# Altium schematic sheet shop roaster psu module board 1.SchDoc
size 420 x 297 mm; SheetNumber: 1; SheetTotal: 1
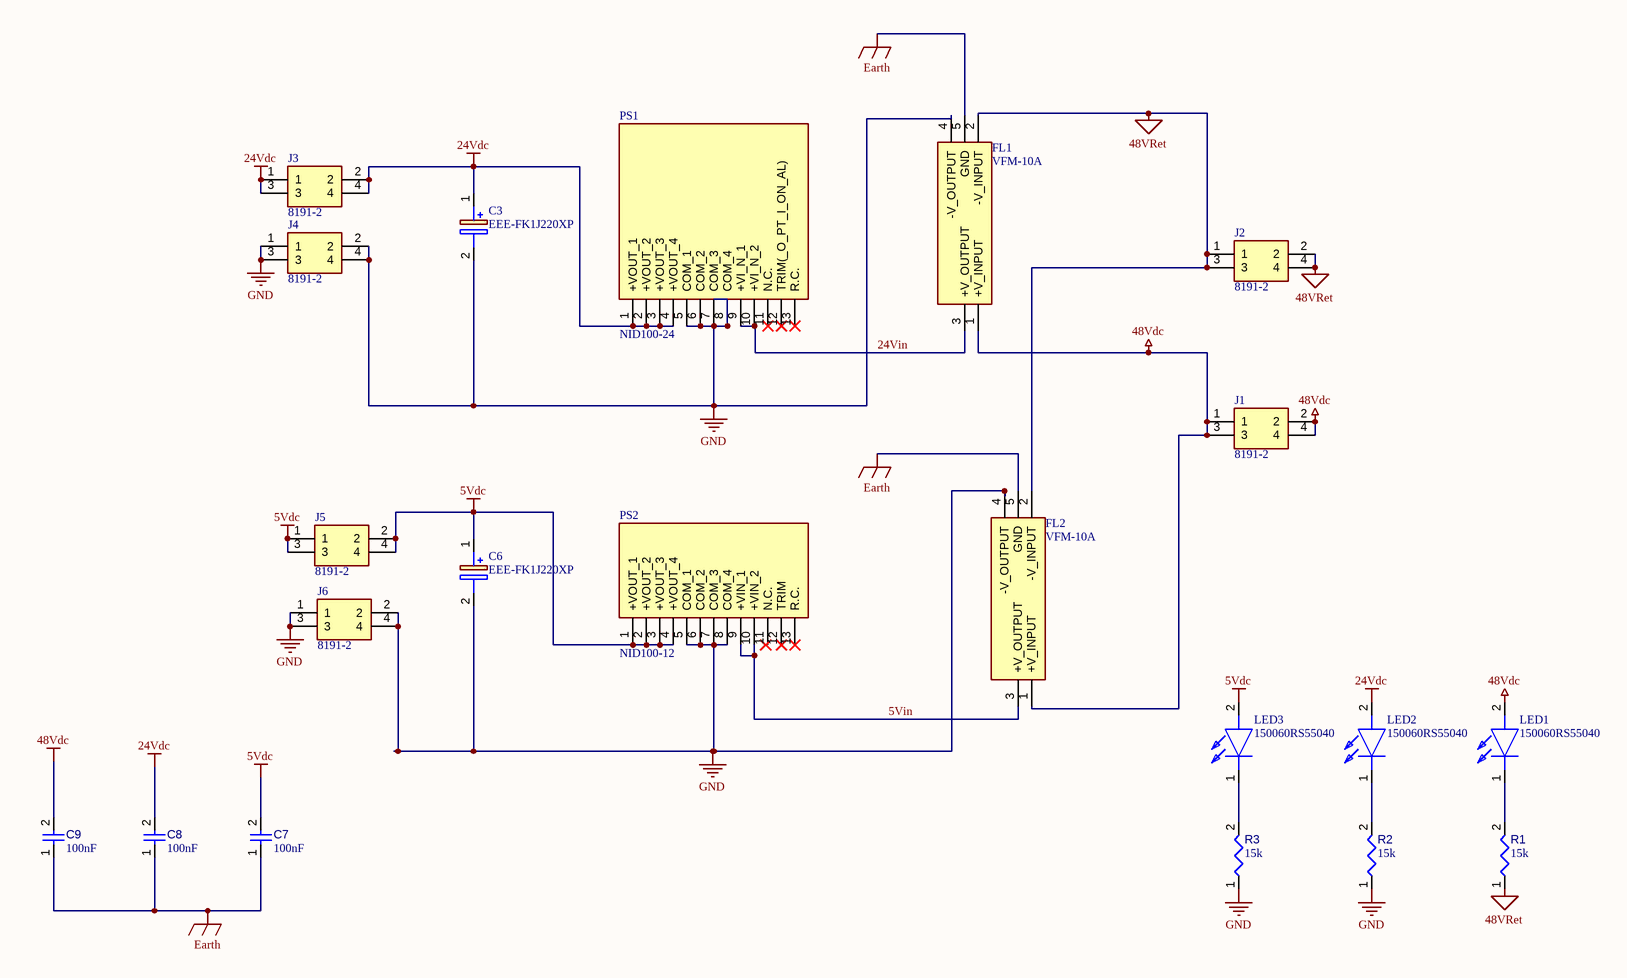
[diagram p0: shop roaster psu module board 1.SchDoc]

## Parts
C3  EEE-FK1J220XP  [EEE0JA331XP]
C6  EEE-FK1J220XP  [EEE0JA331XP]
C7  value 100nF  [CAPC1005X56X25LL10T15]  (hidden comment: Capacitor 0.1 uF +/- 5% 16 V 0402)
C8  value 100nF  [CAPC1005X56X25LL10T15]  (hidden comment: Capacitor 0.1 uF +/- 5% 16 V 0402)
C9  value 100nF  [CAPC1005X56X25LL10T15]  (hidden comment: Capacitor 0.1 uF +/- 5% 16 V 0402)
FL1  VFM-10A  [VFM10A]
FL2  VFM-10A  [VFM10A]
J1  8191-2  [81912]
J2  8191-2  [81912]
J3  8191-2  [81912]
J4  8191-2  [81912]
J5  8191-2  [81912]
J6  8191-2  [81912]
LED1  150060RS55040  [150060RS55040]
LED2  150060RS55040  [150060RS55040]
LED3  150060RS55040  [150060RS55040]
PS1  NID100-24  [NID10024]
PS2  NID100-12  [NID10012]
R1  value 15k  [RESC1005X40X25ML10T10]  (hidden comment: Resistor 15k +/-1% 0402 63 mW)
R2  value 15k  [RESC1005X40X25ML10T10]  (hidden comment: Resistor 15k +/-1% 0402 63 mW)
R3  value 15k  [RESC1005X40X25ML10T10]  (hidden comment: Resistor 15k +/-1% 0402 63 mW)

## Nets
5Vdc: C6.1(+) C7.2 J5.1 J5.2 J5.3 J5.4 LED3.2(A) PS2.1(+VOUT_1) PS2.2(+VOUT_2) PS2.3(+VOUT_3) PS2.4(+VOUT_4)
24Vdc: C3.1(+) C8.2 J3.1 J3.2 J3.3 J3.4 LED2.2(A) PS1.1(+VOUT_1) PS1.2(+VOUT_2) PS1.3(+VOUT_3) PS1.4(+VOUT_4)
48Vdc: C9.2 FL1.1(+V_INPUT) FL2.1(+V_INPUT) J1.1 J1.2 J1.3 J1.4 LED1.2(A)
48VRet: FL1.2(-V_INPUT) FL2.2(-V_INPUT) J2.1 J2.2 J2.3 J2.4 R1.1
Earth: C7.1 C8.1 C9.1 FL1.5(GND) FL2.5(GND)
GND: C3.2(-) C6.2(-) FL1.4(-V_OUTPUT) FL2.4(-V_OUTPUT) J4.1 J4.2 J4.3 J4.4 J6.1 J6.2 J6.3 J6.4 PS1.5(COM_1) PS1.6(COM_2) PS1.7(COM_3) PS1.8(COM_4) PS2.5(COM_1) PS2.6(COM_2) PS2.7(COM_3) PS2.8(COM_4) R2.1 R3.1
5Vin: FL2.3(+V_OUTPUT) PS2.9(+VIN_1) PS2.10(+VIN_2)
24Vin: FL1.3(+V_OUTPUT) PS1.9(+VI_N_1) PS1.10(+VI_N_2)
NetLED1_1: LED1.1(K) R1.2
NetLED2_1: LED2.1(K) R2.2
NetLED3_1: LED3.1(K) R3.2

Not connected (* = marked no-connect by the designer): PS1 11(N.C.)* 12(TRIM(_O_PT_I_ON_AL))* 13(R.C.)*; PS2 11(N.C.) 12(TRIM)* 13(R.C.)*

## Library data of the parts
C3 C6 = EEE-FK1J220XP: Capacitor Polarised; Manufacturer_Name: Panasonic; Datasheet Link: http://industrial.panasonic.com/cdbs/www-data/pdf/RDE0000/ABA0000C1181.pdf; Height: 7.8mm; Manufacturer_Part_Number: EEE-FK1J220XP; Mouser Part Number: 667-EEE-FK1J220XP; Mouser Price/Stock: https://www.mouser.co.uk/ProductDetail/Panasonic/EEE-FK1J220XP?qs=qE6bgDGEOCtReXDhLMMdtw%3D%3D; Arrow Part Number: EEE-FK1J220XP; Arrow Price/Stock: https://www.arrow.com/en/products/eeefk1j220xp/panasonic
C7-C9 = CMP-001-00001-6: Chip Capacitor, 0.1 uF, +/- 5%, 16 V, 0402 (1005 Metric); Capacitor Type: Ceramic; Voltage Rating: 16V; Max Operating Temperature: 125°C; Min Operating Temperature: -55°C; Case/Package: 0402; Mounting Technology: SM; Pins: 2; Tolerance: 5%; RoHS Compliant: True
FL1 FL2 = CMP-002-000003-1: Power Line Filters 0-75Vin 10A DC EMI Filter; Manufacturer_Name: CUI Inc.; Source: SamacSys.SchLib; Height: 11.7mm; Arrow Price/Stock: https://www.arrow.com/en/products/vfm-10a/cui-inc; Arrow Part Number: VFM-10A; Mouser Part Number: 490-VFM-10A; Design Item ID: VFM-10A; Manufacturer_Part_Number: VFM-10A; Datasheet Link: https://www.cui.com/product/resource/vfm-xx.pdf; Mouser Price/Stock: https://www.mouser.co.uk/ProductDetail/CUI-Inc/VFM-10A?qs=WyjlAZoYn52c0yYVx%252BhHOQ%3D%3D
J1-J6 = CMP-002-000000-1: Keystone, Brass Screw Terminal, 22  14 AWG, 15A; Manufacturer_Name: Keystone Electronics; Geometry.Height: 11.176mm; Manufacturer_Part_Number: 8191-2; Source: 8191-2.SchLib; Mouser Price/Stock: https://www.mouser.co.uk/ProductDetail/Keystone-Electronics/8191-2?qs=zBlGwAMnvtcLi4%252BTp6EI2A%3D%3D; Datasheet Link: *; Design Item ID: 8191-2; Mouser Part Number: 534-8191-2
LED1-LED3 = 150060RS55040: LED; Manufacturer_Name: Wurth Elektronik; Datasheet Link: http://katalog.we-online.de/led/datasheet/150060RS55040.pdf; Height: 0mm; Manufacturer_Part_Number: 150060RS55040; Mouser Part Number: 710-150060RS55040; Mouser Price/Stock: https://www.mouser.co.uk/ProductDetail/Wurth-Elektronik/150060RS55040?qs=8Aam6%252B7C6HHnMZFlrlTntA%3D%3D
PS1 = NID100-24: Power Supply; Manufacturer_Name: Mean Well; Datasheet Link: https://www.meanwellusa.com/webapp/product/search.aspx?prod=NID100#1; Height: 27.5mm; Manufacturer_Part_Number: NID100-24; Mouser Part Number: 709-NID100-24; Mouser Price/Stock: https://www.mouser.co.uk/ProductDetail/MEAN-WELL/NID100-24?qs=u16ybLDytRYj3KEXttNRbg%3D%3D; Arrow Part Number: NID100-24; Arrow Price/Stock: https://www.arrow.com/en/products/nid100-24/mean-well-enterprises?region=nac
PS2 = NID100-12: Power Supply; Manufacturer_Name: Mean Well; Datasheet Link: https://www.meanwell-web.com/content/files/pdfs/productPdfs/MW/NID100/NID100-spec.pdf; Height: 27.5mm; Manufacturer_Part_Number: NID100-12; Mouser Part Number: 709-NID100-12; Mouser Price/Stock: https://www.mouser.co.uk/ProductDetail/MEAN-WELL/NID100-12?qs=u16ybLDytRakdcW8%2FWhQZg%3D%3D; Arrow Part Number: NID100-12; Arrow Price/Stock: https://www.arrow.com/en/products/nid100-12/mean-well-enterprises?region=nac
R1-R3 = CMP-009-00026-5: Chip Resistor, 15 KOhm, +/- 1%, 0.063 W, -55 to 155 degC, 0402 (1005 Metric); Power: 63mW; Min Operating Temperature: -55°C; Tolerance: 1%; Max Operating Temperature: 155°C; Mounting Technology: SM; Case/Package: 0402; RoHS Compliant: True; Pins: 2